# EAGLE design PCB (EAGLE 7.7.0)
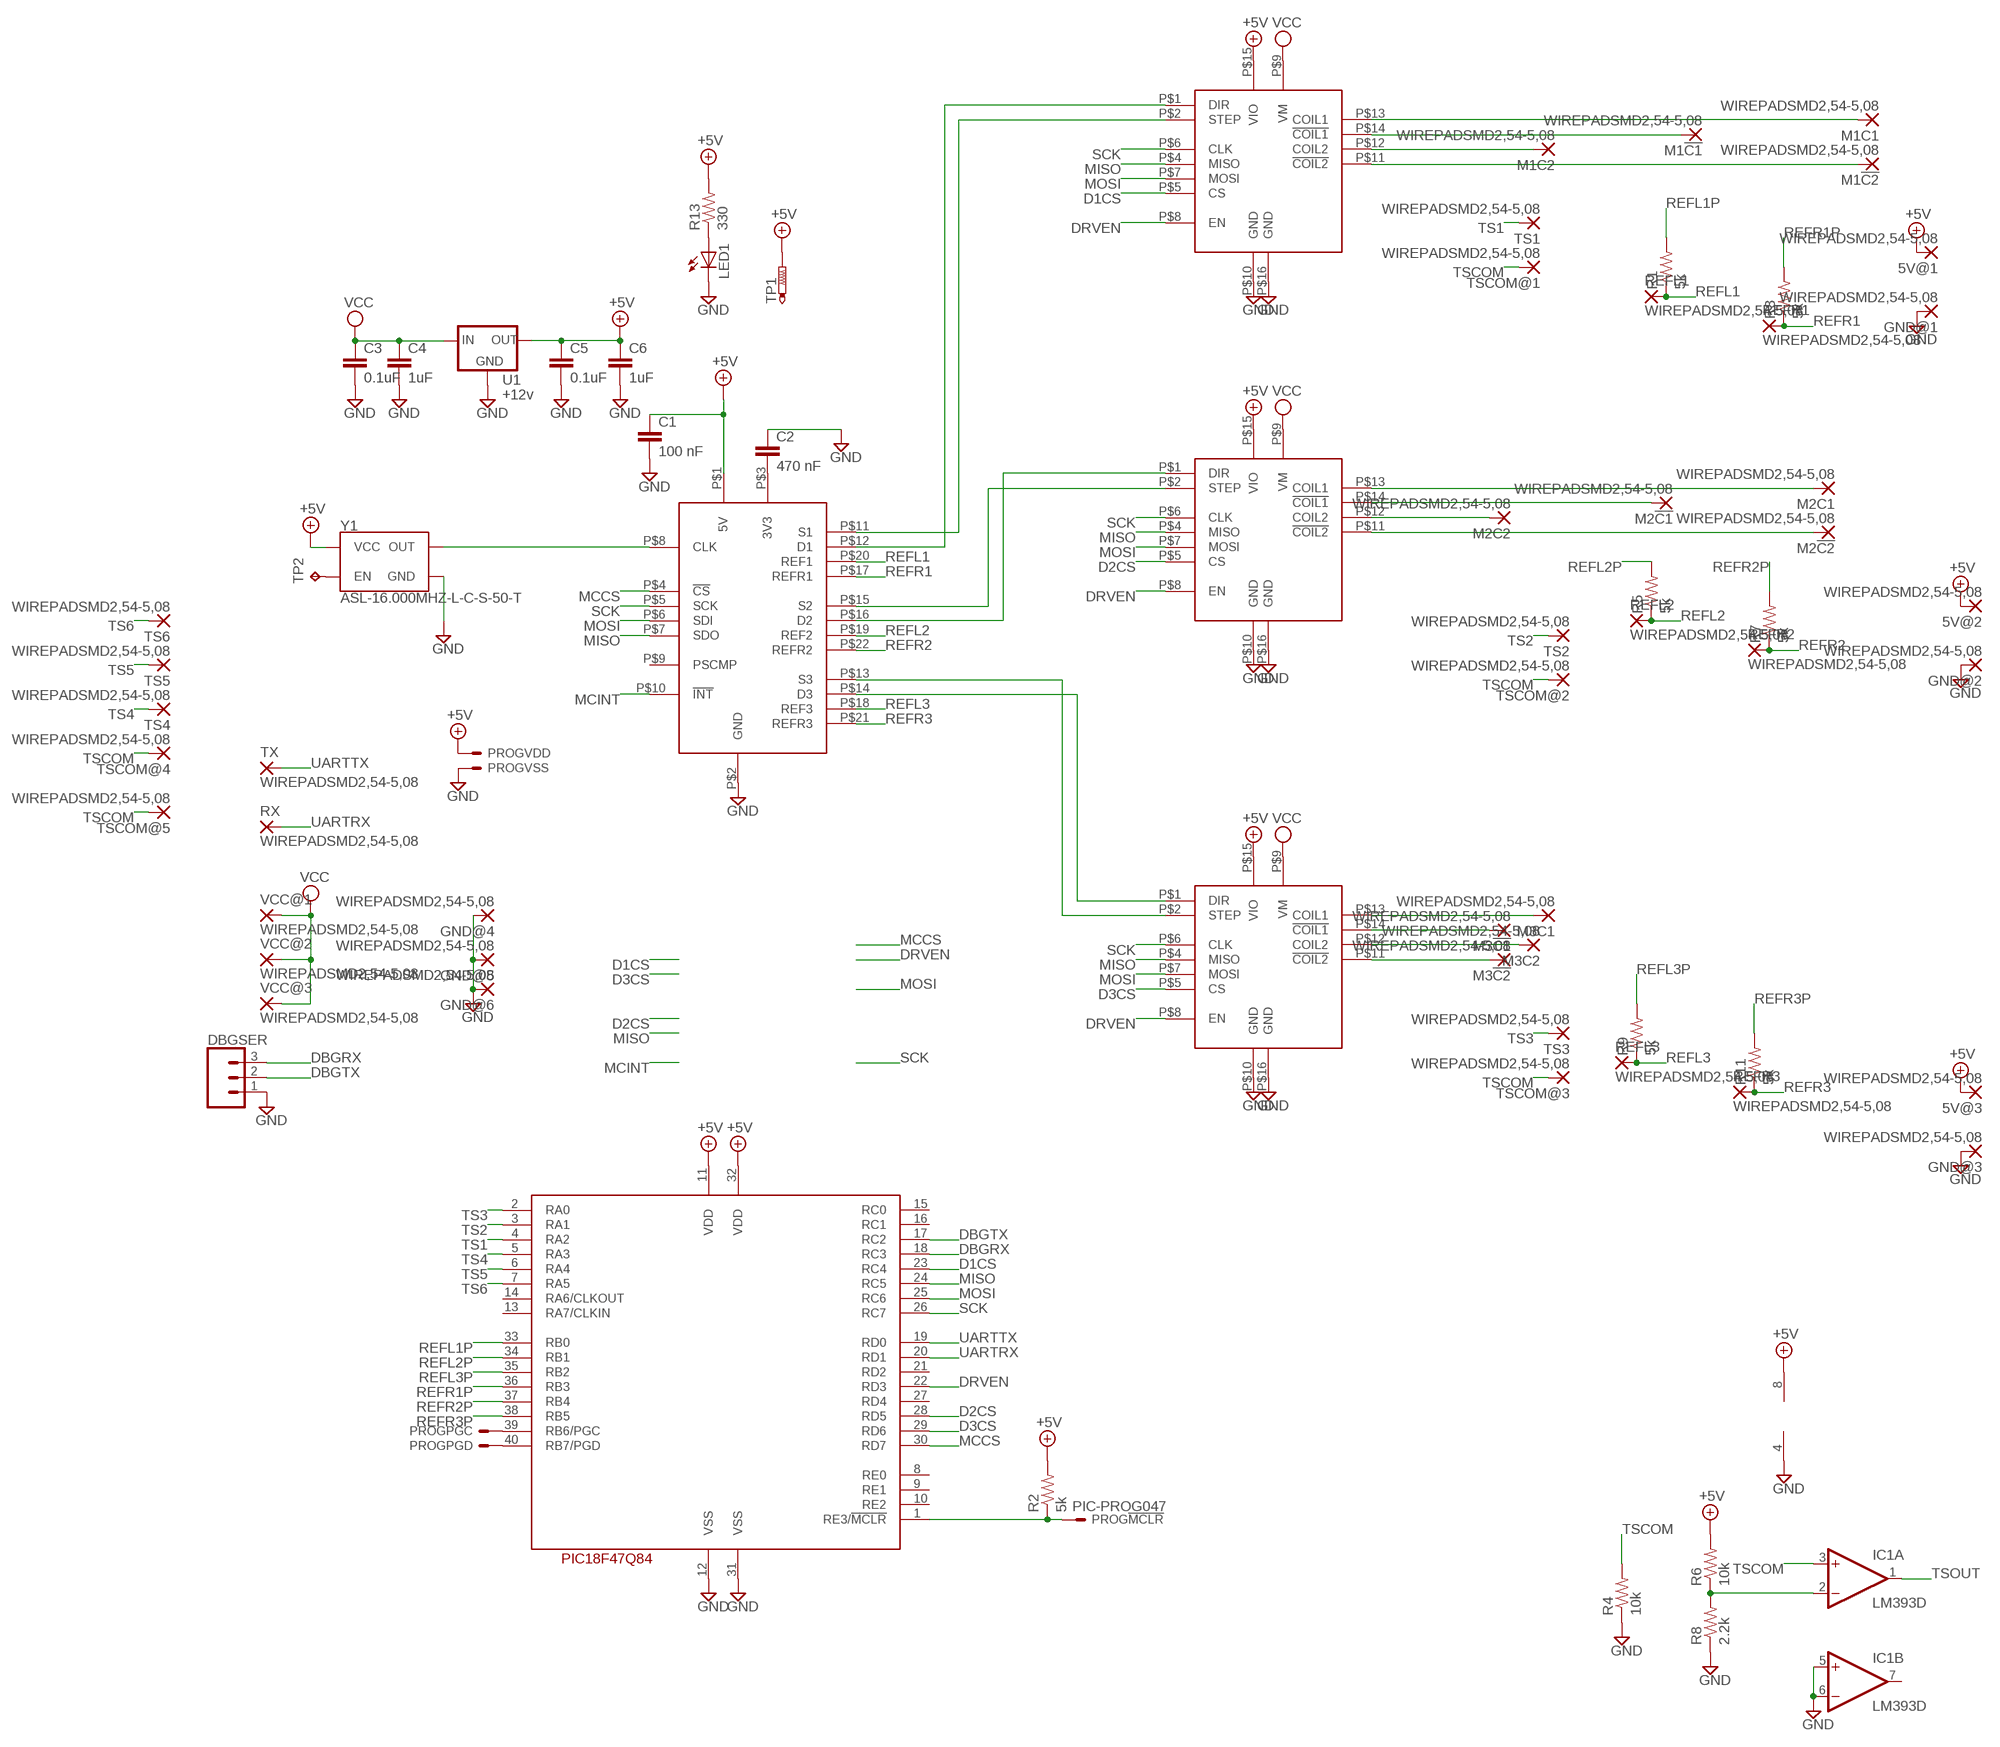
[diagram p0: schematic, sheet 1]

## Parts
5V@1  WIREPADSMD2,54-5,08  [SMD2,54-5,08]
5V@2  WIREPADSMD2,54-5,08  [SMD2,54-5,08]
5V@3  WIREPADSMD2,54-5,08  [SMD2,54-5,08]
C1  100 nF  C-EUC1206  [C1206]
C2  470 nF  C-EUC1206  [C1206]
C3  0.1uF  C-EUC1206  [C1206]
C4  1uF  C-EUC1206  [C1206]
C5  0.1uF  C-EUC1206  [C1206]
C6  1uF  C-EUC1206  [C1206]
DBGSER  CONN_03  [1X03]
DRV1  SILENTSTEPSTICK-DIPONLY  [SILENTSTEPSTICK-DIPONLY]
DRV2  SILENTSTEPSTICK-DIPONLY  [SILENTSTEPSTICK-DIPONLY]
DRV3  SILENTSTEPSTICK-DIPONLY  [SILENTSTEPSTICK-DIPONLY]
GND@1  WIREPADSMD2,54-5,08  [SMD2,54-5,08]
GND@2  WIREPADSMD2,54-5,08  [SMD2,54-5,08]
GND@3  WIREPADSMD2,54-5,08  [SMD2,54-5,08]
GND@4  WIREPADSMD2,54-5,08  [SMD2,54-5,08]
GND@5  WIREPADSMD2,54-5,08  [SMD2,54-5,08]
GND@6  WIREPADSMD2,54-5,08  [SMD2,54-5,08]
IC1  LM393D  [SO08]
LED1  LEDCHIPLED_1206  [CHIPLED_1206]
M1!C1  WIREPADSMD2,54-5,08  [SMD2,54-5,08]
M1!C2  WIREPADSMD2,54-5,08  [SMD2,54-5,08]
M1C1  WIREPADSMD2,54-5,08  [SMD2,54-5,08]
M1C2  WIREPADSMD2,54-5,08  [SMD2,54-5,08]
M2!C1  WIREPADSMD2,54-5,08  [SMD2,54-5,08]
M2!C2  WIREPADSMD2,54-5,08  [SMD2,54-5,08]
M2C1  WIREPADSMD2,54-5,08  [SMD2,54-5,08]
M2C2  WIREPADSMD2,54-5,08  [SMD2,54-5,08]
M3!C1  WIREPADSMD2,54-5,08  [SMD2,54-5,08]
M3!C2  WIREPADSMD2,54-5,08  [SMD2,54-5,08]
M3C1  WIREPADSMD2,54-5,08  [SMD2,54-5,08]
M3C2  WIREPADSMD2,54-5,08  [SMD2,54-5,08]
PROG  PIC-PROG047  [53047-05]
R1  5k  R-US_M1206  [M1206]
R2  5k  R-US_M1206  [M1206]
R3  5k  R-US_M1206  [M1206]
R4  10k  R-US_M1206  [M1206]
R5  5k  R-US_M1206  [M1206]
R6  10k  R-US_M1206  [M1206]
R7  5k  R-US_M1206  [M1206]
R8  2.2k  R-US_M1206  [M1206]
R9  5k  R-US_M1206  [M1206]
R11  5k  R-US_M1206  [M1206]
R13  330  R-US_M1206  [M1206]
REFL1  WIREPADSMD2,54-5,08  [SMD2,54-5,08]
REFL2  WIREPADSMD2,54-5,08  [SMD2,54-5,08]
REFL3  WIREPADSMD2,54-5,08  [SMD2,54-5,08]
REFR1  WIREPADSMD2,54-5,08  [SMD2,54-5,08]
REFR2  WIREPADSMD2,54-5,08  [SMD2,54-5,08]
REFR3  WIREPADSMD2,54-5,08  [SMD2,54-5,08]
RX  WIREPADSMD2,54-5,08  [SMD2,54-5,08]
TP1  PTR1PAD1-17  [P1-17]
TP2  TPB1,27  [B1,27]
TS1  WIREPADSMD2,54-5,08  [SMD2,54-5,08]
TS2  WIREPADSMD2,54-5,08  [SMD2,54-5,08]
TS3  WIREPADSMD2,54-5,08  [SMD2,54-5,08]
TS4  WIREPADSMD2,54-5,08  [SMD2,54-5,08]
TS5  WIREPADSMD2,54-5,08  [SMD2,54-5,08]
TS6  WIREPADSMD2,54-5,08  [SMD2,54-5,08]
TSCOM@1  WIREPADSMD2,54-5,08  [SMD2,54-5,08]
TSCOM@2  WIREPADSMD2,54-5,08  [SMD2,54-5,08]
TSCOM@3  WIREPADSMD2,54-5,08  [SMD2,54-5,08]
TSCOM@4  WIREPADSMD2,54-5,08  [SMD2,54-5,08]
TSCOM@5  WIREPADSMD2,54-5,08  [SMD2,54-5,08]
TX  WIREPADSMD2,54-5,08  [SMD2,54-5,08]
U1  +12v  V_REG_78XX7812  [TO-252]
U2  PIC18F47Q84  [DIL40]
U$1  TMC429-BOB  [TMC429-BOB]
VCC@1  WIREPADSMD2,54-5,08  [SMD2,54-5,08]
VCC@2  WIREPADSMD2,54-5,08  [SMD2,54-5,08]
VCC@3  WIREPADSMD2,54-5,08  [SMD2,54-5,08]
Y1  ASL-16.000MHZ-L-C-S-50-T  OSCILLATORSMD-7X5-4PAD  [OSCILLATOR-SMD-7X5-4PAD]

## Nets
+5V: 5V@1.1(P) 5V@2.1(P) 5V@3.1(P) C1.1 C5.1 C6.1 DRV1.P$15(VIO) DRV2.P$15(VIO) DRV3.P$15(VIO) IC1.8(P:V+) PROG.2 R2.2 R6.2 R13.2 TP1.TP U1.2(OUT) U2.11(VDD) U2.32(VDD) U$1.P$1(5V) Y1.4(VCC)
D1CS: DRV1.P$5(CS) U2.23(RC4)
D2CS: DRV2.P$5(CS) U2.28(RD5)
D3CS: DRV3.P$5(CS) U2.29(RD6)
DBGRX: DBGSER.3 U2.18(RC3)
DBGTX: DBGSER.2 U2.17(RC2)
DRVEN: DRV1.P$8(EN) DRV2.P$8(EN) DRV3.P$8(EN) U2.22(RD3)
GND: C1.2 C2.1 C3.2 C4.2 C5.2 C6.2 DBGSER.1 DRV1.P$10(GND) DRV1.P$16(GND) DRV2.P$10(GND) DRV2.P$16(GND) DRV3.P$10(GND) DRV3.P$16(GND) GND@1.1(P) GND@2.1(P) GND@3.1(P) GND@4.1(P) GND@5.1(P) GND@6.1(P) IC1.4(P:V-) IC1.5(B:+IN) IC1.6(B:-IN) LED1.C PROG.3 R4.1 R8.1 U1.3(GND) U2.12(VSS) U2.31(VSS) U$1.P$2(GND) Y1.2(GND)
MCCS: U2.30(RD7) U$1.P$4(!CS)
MCINT: U$1.P$10(!INT)
MISO: DRV1.P$4(MISO) DRV2.P$4(MISO) DRV3.P$4(MISO) U2.24(RC5) U$1.P$7(SDO)
MOSI: DRV1.P$7(MOSI) DRV2.P$7(MOSI) DRV3.P$7(MOSI) U2.25(RC6) U$1.P$6(SDI)
N$1: DRV1.P$1(DIR) U$1.P$12(D1)
N$2: DRV1.P$2(STEP) U$1.P$11(S1)
N$3: DRV2.P$2(STEP) U$1.P$15(S2)
N$4: DRV2.P$1(DIR) U$1.P$16(D2)
N$5: DRV3.P$2(STEP) U$1.P$13(S3)
N$6: DRV3.P$1(DIR) U$1.P$14(D3)
N$7: C2.2 U$1.P$3(3V3)
N$8: DRV1.P$13(COIL1) M1C1.1(P)
N$9: DRV1.P$12(COIL2) M1C2.1(P)
N$10: DRV1.P$14(!COIL1) M1!C1.1(P)
N$11: DRV1.P$11(!COIL2) M1!C2.1(P)
N$12: DRV2.P$14(!COIL1) M2!C1.1(P)
N$13: DRV2.P$12(COIL2) M2C2.1(P)
N$14: DRV2.P$11(!COIL2) M2!C2.1(P)
N$15: DRV2.P$13(COIL1) M2C1.1(P)
N$16: DRV3.P$14(!COIL1) M3!C1.1(P)
N$17: DRV3.P$12(COIL2) M3C2.1(P)
N$18: DRV3.P$13(COIL1) M3C1.1(P)
N$19: DRV3.P$11(!COIL2) M3!C2.1(P)
N$20: PROG.4 U2.40(RB7/PGD)
N$21: PROG.1 R2.1 U2.1(RE3/!MCLR)
N$22: PROG.5 U2.39(RB6/PGC)
N$23: U$1.P$8(CLK) Y1.3(OUT)
N$24: TP2.TP Y1.1(EN)
N$26: IC1.2(A:-IN) R6.1 R8.2
N$32: LED1.A R13.1
REFL1: R1.1 REFL1.1(P) U$1.P$20(REF1)
REFL1P: R1.2 U2.33(RB0)
REFL2: R5.1 REFL2.1(P) U$1.P$19(REF2)
REFL2P: R5.2 U2.34(RB1)
REFL3: R9.1 REFL3.1(P) U$1.P$18(REF3)
REFL3P: R9.2 U2.35(RB2)
REFR1: R3.1 REFR1.1(P) U$1.P$17(REFR1)
REFR1P: R3.2 U2.36(RB3)
REFR2: R7.1 REFR2.1(P) U$1.P$22(REFR2)
REFR2P: R7.2 U2.37(RB4)
REFR3: R11.1 REFR3.1(P) U$1.P$21(REFR3)
REFR3P: R11.2 U2.38(RB5)
SCK: DRV1.P$6(CLK) DRV2.P$6(CLK) DRV3.P$6(CLK) U2.26(RC7) U$1.P$5(SCK)
TS1: TS1.1(P) U2.4(RA2)
TS2: TS2.1(P) U2.3(RA1)
TS3: TS3.1(P) U2.2(RA0)
TS4: TS4.1(P) U2.5(RA3)
TS5: TS5.1(P) U2.6(RA4)
TS6: TS6.1(P) U2.7(RA5)
TSCOM: IC1.3(A:+IN) R4.2 TSCOM@1.1(P) TSCOM@2.1(P) TSCOM@3.1(P) TSCOM@4.1(P) TSCOM@5.1(P)
TSOUT: IC1.1(A:OUT)
UARTRX: RX.1(P) U2.20(RD1)
UARTTX: TX.1(P) U2.19(RD0)
VCC: C3.1 C4.1 DRV1.P$9(VM) DRV2.P$9(VM) DRV3.P$9(VM) U1.1(IN) VCC@1.1(P) VCC@2.1(P) VCC@3.1(P)
Unconnected: IC1.7(B:OUT) U2.8(RE0) U2.9(RE1) U2.10(RE2) U2.13(RA7/CLKIN) U2.14(RA6/CLKOUT) U2.15(RC0) U2.16(RC1) U2.21(RD2) U2.27(RD4) U$1.P$9(PSCMP)

## Library data of the parts
5V@1-5V@3 GND@1-GND@6 M1!C1 M1!C2 M1C1 M1C2 M2!C1 M2!C2 M2C1 M2C2 M3!C1 M3!C2 M3C1 M3C2 REFL1-REFL3 REFR1-REFR3 RX TS1-TS6 TSCOM@1-TSCOM@5 TX VCC@1-VCC@3 = wirepad:WIREPAD: Wire PAD connect wire on PCB
C1-C6 = resistor:C-EU: CAPACITOR, European symbol
DBGSER = SparkFun-Connectors:CONN_03: Multi connection point. Often used as Generic Header-pin footprint for 0.1 inch spaced/style header connections On any of the 0.1 inch spaced packages, you can populate with these: Break Away Headers - Straight <https://www.sparkfun.com/products/116> (PRT-00116) Break Away Male Headers - Right Angle <https://www.sparkfun.com/products/553> (PRT-00553) Female Headers <https://www.sparkfun.com/products/115> (PRT-00115) Break Away Headers - Machine Pin <https://www.sparkfun.com/products/117> (PRT-00117) Break Away Female Headers - Swiss Machine Pin <https://www.sparkfun.com/products/743> (PRT-00743) Stackable Header - 3 Pin (Female, 0.1") <https://www.sparkfun.com/products/13875> (PRT-13875) For SCREWTERMINALS and SPRING TERMINALS visit here: Screw Terimnals on SparkFun.com <https://www.sparkfun.com/search/results?term=Screw+Terminals> (5mm/3.5mm/2.54mm spacing) This device is also useful as a general connection point to wire up your design to another part of your project. Our various solder wires solder well into these plated through hole pads. Hook-Up Wire - Assortment (Stranded, 22 AWG) <https://www.sparkfun.com/products/11375> (PRT-11375) Hook-Up Wire - Assortment (Solid Core, 22 AWG) <https://www.sparkfun.com/products/11367> (PRT-11367) View the entire wire category on our website here <https://www.sparkfun.com/categories/141> Special notes: Molex polarized connector foot print use with SKU : PRT-08232 with associated crimp pins and housings.
DRV1-DRV3 = FRC696:SILENTSTEPSTICK-DIPONLY
IC1 = linear:LM393: COMPARATOR
LED1 = led:LED: LED OSRAM: - CHIPLED LG R971, LG N971, LY N971, LG Q971, LY Q971, LO R971, LY R971 LH N974, LH R974 LS Q976, LO Q976, LY Q976 LO Q996 - Hyper CHIPLED LW Q18S LB Q993, LB Q99A, LB R99A - SideLED LS A670, LO A670, LY A670, LG A670, LP A670 LB A673, LV A673, LT A673, LW A673 LH A674 LY A675 LS A676, LA A676, LO A676, LY A676, LW A676 LS A679, LY A679, LG A679 - Hyper Micro SIDELED® LS Y876, LA Y876, LO Y876, LY Y876 LT Y87S - SmartLED LW L88C, LW L88S LB L89C, LB L89S, LG L890 LS L89K, LO L89K, LY L89K LS L896, LA L896, LO L896, LY L896 - TOPLED LS T670, LO T670, LY T670, LG T670, LP T670 LSG T670, LSP T670, LSY T670, LOP T670, LYG T670 LG T671, LOG T671, LSG T671 LB T673, LV T673, LT T673, LW T673 LH T674 LS T676, LA T676, LO T676, LY T676, LB T676, LH T676, LSB T676, LW T676 LB T67C, LV T67C, LT T67C, LS T67K, LO T67K, LY T67K, LW E67C LS E67B, LA E67B, LO E67B, LY E67B, LB E67C, LV E67C, LT E67C LW T67C LS T679, LY T679, LG T679 LS T770, LO T770, LY T770, LG T770, LP T770 LB T773, LV T773, LT T773, LW T773 LH T774 LS E675, LA E675, LY E675, LS T675 LS T776, LA T776, LO T776, LY T776, LB T776 LHGB T686 LT T68C, LB T68C - Hyper Mini TOPLED® LB M676 - Mini TOPLED Santana® LG M470 LS M47K, LO M47K, LY M47K Source: http://www.osram.convergy.de LUXEON: - LUMILED® LXK2-PW12-R00, LXK2-PW12-S00, LXK2-PW14-U00, LXK2-PW14-V00 LXK2-PM12-R00, LXK2-PM12-S00, LXK2-PM14-U00 LXK2-PE12-Q00, LXK2-PE12-R00, LXK2-PE12-S00, LXK2-PE14-T00, LXK2-PE14-U00 LXK2-PB12-K00, LXK2-PB12-L00, LXK2-PB12-M00, LXK2-PB14-N00, LXK2-PB14-P00, LXK2-PB14-Q00 LXK2-PR12-L00, LXK2-PR12-M00, LXK2-PR14-Q00, LXK2-PR14-R00 LXK2-PD12-Q00, LXK2-PD12-R00, LXK2-PD12-S00 LXK2-PH12-R00, LXK2-PH12-S00 LXK2-PL12-P00, LXK2-PL12-Q00, LXK2-PL12-R00 Source: www.luxeon.com KINGBRIGHT: KA-3528ASYC Source: www.kingbright.com
PROG = FRC696:PIC-PROG: CONNECTOR wire to board 1.25 mm (.049 inch) pitch header; MF: MOLEX; MPN: 53047-0510; OC_FARNELL: 9732861; OC_NEWARK: 38C9901
R1-R9 R11 R13 = resistor:R-US_: RESISTOR, American symbol
TP1 = testpad:PTR1: TEST PIN
TP2 = testpad:TP: Test pad
U1 = SparkFun-IC-Power:V_REG_78XX: Voltage Regulator Standard 78xx regulator. IGO (Input Ground Output). Spark Fun Electronics SKU : COM-00107; PROD_ID: VREG-12370
U2 = FRC696:PIC18F47Q84
U$1 = FRC696:TMC429-BOB
Y1 = SparkFun-Clocks:OSCILLATOR: Oscillators (Generic) These are active oscillators, which require a power source to generate their clock output. Most oscillators are configured to generate a set frequency (e.g. 16MHz). They have four pins: power, ground, output, and an enable input.

## Board
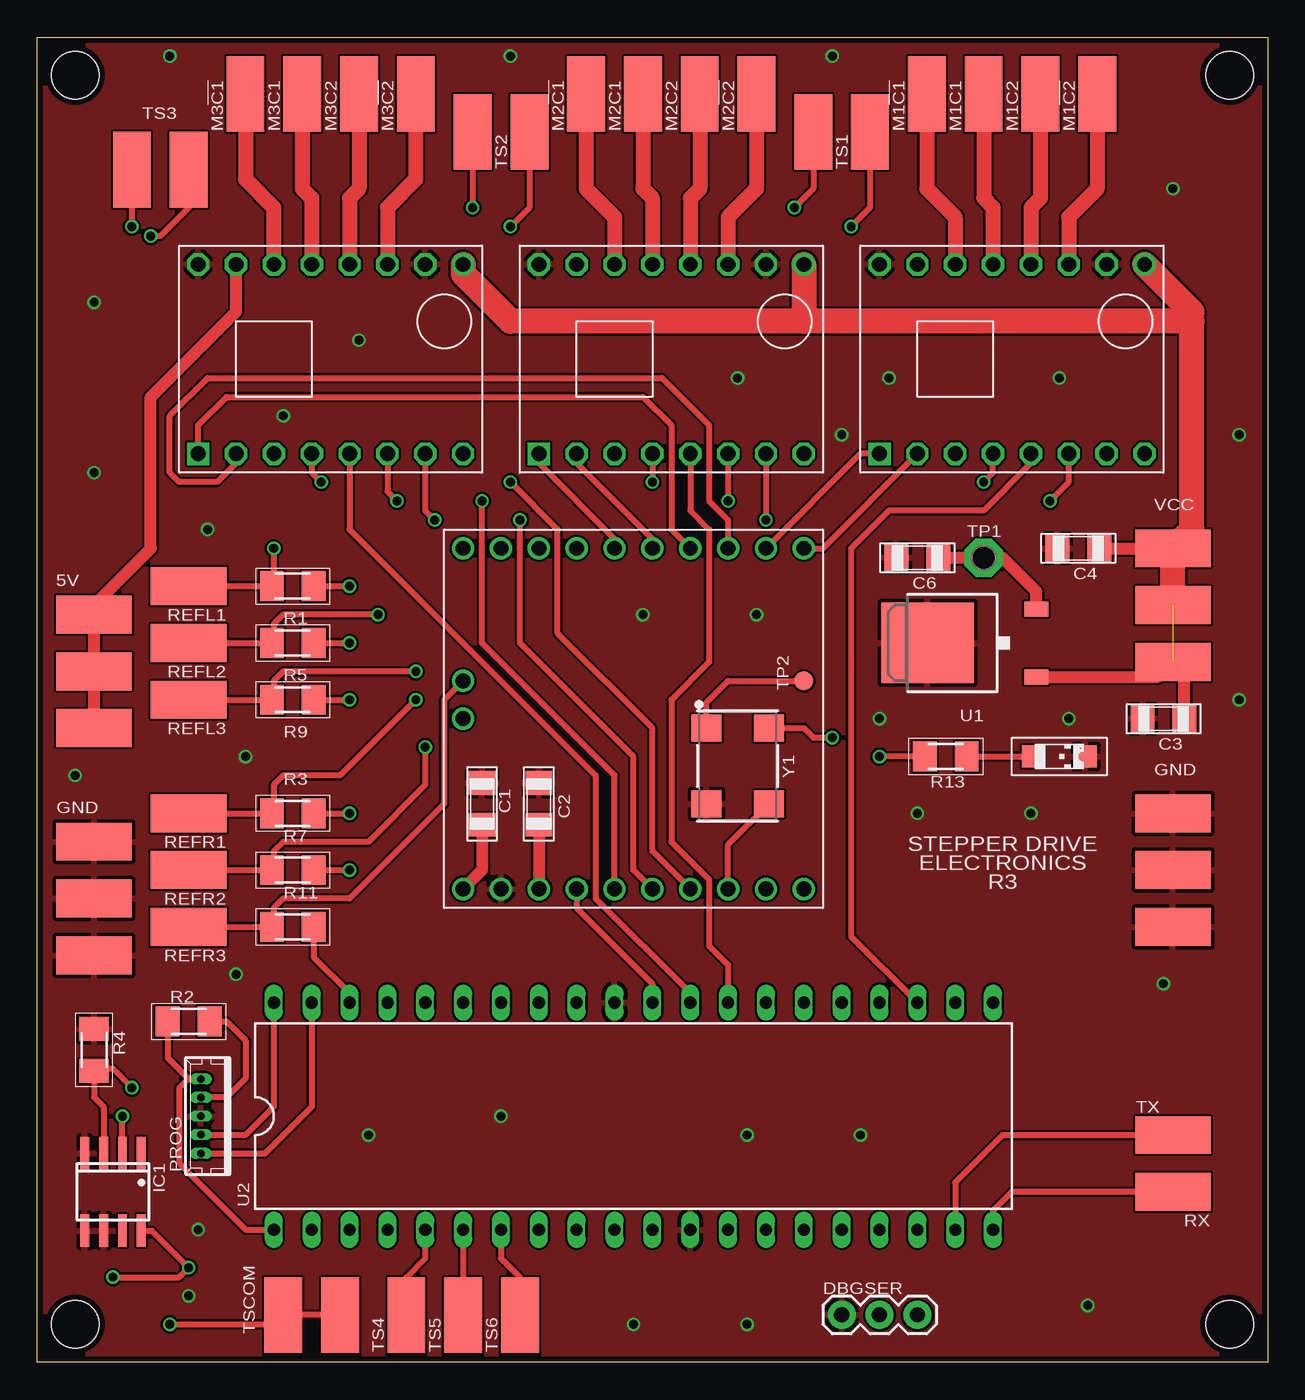
[diagram p1: board, top side]
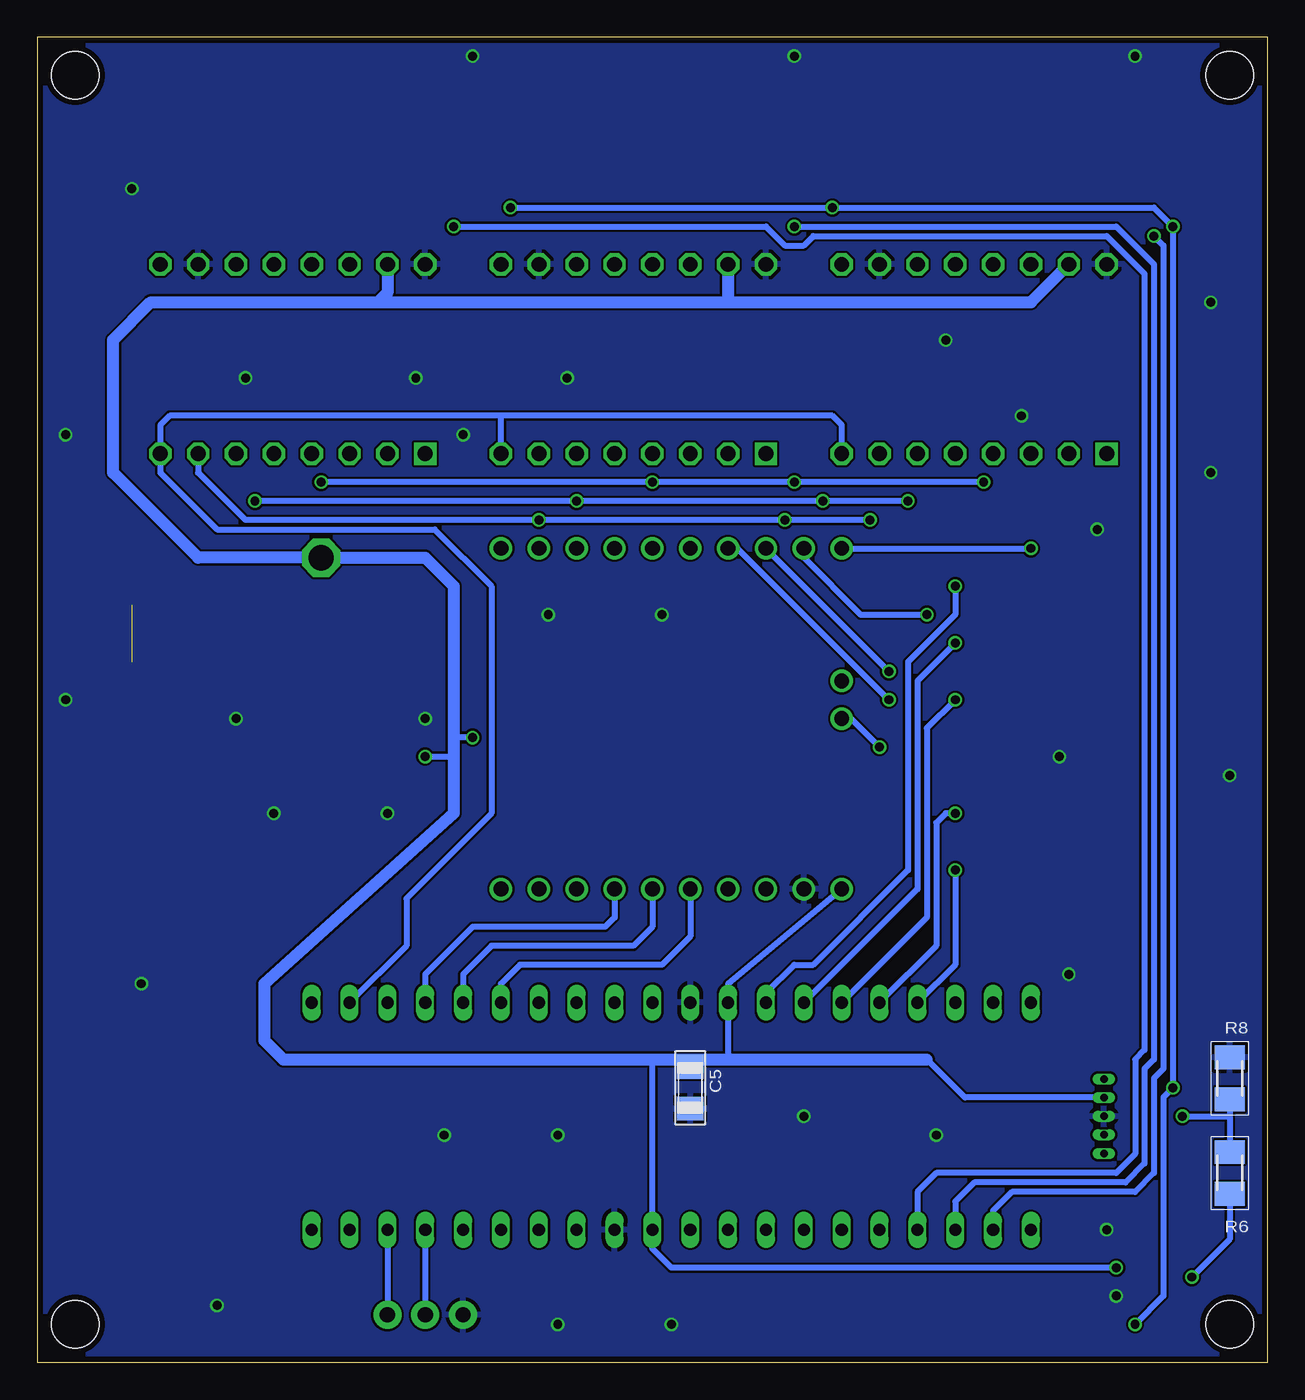
[diagram p2: board, bottom side, seen from below]

Size 82.55 x 88.9 mm. Coordinates in mm from the lower left corner, seen from the top.
Outline: 0,88.9 82.55,88.9 82.55,0 0,0 0,88.9
Copper layers (1*16): Top 0.035559375mm / dielectric 1.6mm / Bottom 0.035559375mm
Design rules "oshpark-2layer": minimum track width 6mil, minimum drill 10mil, track to track 6mil, track to pad 6mil, pad to pad 6mil, via to via 6mil, smd to smd 6mil, copper to edge 15mil, drill to drill 6mil, minimum pad ring 5mil, minimum via ring 5mil, stop-mask expansion 2.5mil, vias tented up to drill 0mil, thermal gap 10mil
Holes 3.2 mm at 80.01,2.54 80.01,86.36 2.54,86.36 2.54,2.54

### Footprints (pad centres in the part's own frame; a part is rotated, then mirrored left to right if it is on the bottom)
SMD2,54-5,08 = smd 2.54 x 5.08: 1 0,0
C1206 = smd 1.6 x 1.8: 1 -1.4,0; 2 1.4,0
1X03 = drill 1.016 pad 1.88: 1 0,0; 2 2.54,0; 3 5.08,0
SILENTSTEPSTICK-DIPONLY = drill 1 square: P$1 -6.35,7.62 | drill 1 octagon: P$2 -6.35,5.08; P$3 -6.35,2.54; P$4 -6.35,0; P$5 -6.35,-2.54; P$6 -6.35,-5.08; P$7 -6.35,-7.62; P$8 -6.35,-10.16; P$9 6.35,-10.16; P$10 6.35,-7.62; P$11 6.35,-5.08; P$12 6.35,-2.54; P$13 6.35,0; P$14 6.35,2.54; P$15 6.35,5.08; P$16 6.35,7.62
SO08 = smd 0.6 x 2.2: 1 -1.905,-2.6; 2 -0.635,-2.6; 3 0.635,-2.6; 4 1.905,-2.6; 5 1.905,2.6; 6 0.635,2.6; 7 -0.635,2.6; 8 -1.905,2.6
CHIPLED_1206 = smd 1.5 x 1.5: A 0,-1.75; C 0,1.75
53047-05 = drill 0.5 pad 0.698 long: 1 2.5,0.45; 2 1.25,0.45; 3 0,0.45; 4 -1.25,0.45; 5 -2.5,0.45
M1206 = smd 1.6 x 2: 1 -1.4,0; 2 1.4,0
P1-17 = drill 1.702 pad 2.54 octagon: TP 0,0
B1,27 = smd 1.27 x 1.27: TP 0,0
TO-252 = smd 1 x 1.6: 1 -2.28,-4.8; 2 2.28,-4.8 | smd 5.4 x 6.2: 3 0,2.5
DIL40 = drill 0.813 long: 1 -24.13,-7.62; 2 -21.59,-7.62; 3 -19.05,-7.62; 4 -16.51,-7.62; 5 -13.97,-7.62; 6 -11.43,-7.62; 7 -8.89,-7.62; 8 -6.35,-7.62; 9 -3.81,-7.62; 10 -1.27,-7.62; 11 1.27,-7.62; 12 3.81,-7.62; 13 6.35,-7.62; 14 8.89,-7.62; 15 11.43,-7.62; 16 13.97,-7.62; 17 16.51,-7.62; 18 19.05,-7.62; 19 21.59,-7.62; 20 24.13,-7.62; 21 24.13,7.62; 22 21.59,7.62; 23 19.05,7.62; 24 16.51,7.62; 25 13.97,7.62; 26 11.43,7.62; 27 8.89,7.62; 28 6.35,7.62; 29 3.81,7.62; 30 1.27,7.62; 31 -1.27,7.62; 32 -3.81,7.62; 33 -6.35,7.62; 34 -8.89,7.62; 35 -11.43,7.62; 36 -13.97,7.62; 37 -16.51,7.62; 38 -19.05,7.62; 39 -21.59,7.62; 40 -24.13,7.62
TMC429-BOB = drill 1: P$1 -11.43,10.16; P$2 -11.43,7.62; P$3 -11.43,5.08; P$4 -11.43,2.54; P$5 -11.43,0; P$6 -11.43,-2.54; P$7 -11.43,-5.08; P$8 -11.43,-7.62; P$9 -11.43,-10.16; P$10 -11.43,-12.7; P$11 11.43,-12.7; P$12 11.43,-10.16; P$13 11.43,-7.62; P$14 11.43,-5.08; P$15 11.43,-2.54; P$16 11.43,0; P$17 11.43,2.54; P$18 11.43,5.08; P$19 11.43,7.62; P$20 11.43,10.16; P$21 2.54,10.16; P$22 0,10.16
OSCILLATOR-SMD-7X5-4PAD = smd 1.8 x 2: 1 -2.54,-2.095; 2 2.54,-2.095; 3 2.54,2.104; 4 -2.54,2.104

### Placement (x,y rotation side)
5V@1  3.81,50.16 90 top
5V@2  3.81,46.35 90 top
5V@3  3.81,42.55 90 top
C1  29.84,37.47 90 top
C2  33.66,37.47 270 top
C3  75.56,43.18 180 top
C4  69.85,54.61 180 top
C5  38.73,18.41 270 bottom
C6  59.05,53.98 180 top
DBGSER  53.98,3.17 0 top
DRV1  64.14,67.31 90 top
DRV2  41.27,67.31 90 top
DRV3  18.41,67.31 90 top
GND@1  3.81,34.92 90 top
GND@2  3.81,31.11 90 top
GND@3  3.81,27.3 90 top
GND@4  76.2,33.02 90 top
GND@5  76.2,36.83 90 top
GND@6  76.2,29.21 90 top
IC1  5.08,11.43 180 top
LED1  68.58,40.64 270 top
M1!C1  59.69,85.09 0 top
M1!C2  71.12,85.09 0 top
M1C1  63.5,85.09 0 top
M1C2  67.31,85.09 0 top
M2!C1  36.83,85.09 0 top
M2!C2  48.26,85.09 0 top
M2C1  40.64,85.09 0 top
M2C2  44.45,85.09 0 top
M3!C1  13.97,85.09 0 top
M3!C2  25.4,85.09 0 top
M3C1  17.78,85.09 0 top
M3C2  21.59,85.09 0 top
PROG  11.43,16.51 90 top
R1  17.14,52.07 0 top
R2  10.16,22.86 0 top
R3  17.14,36.83 0 top
R4  3.81,20.95 270 top
R5  17.14,48.26 0 top
R6  2.54,12.7 270 bottom
R7  17.14,33.02 0 top
R8  2.54,19.05 270 bottom
R9  17.14,44.45 0 top
R11  17.14,29.21 0 top
R13  60.96,40.64 180 top
REFL1  10.16,52.07 90 top
REFL2  10.16,48.26 90 top
REFL3  10.16,44.45 90 top
REFR1  10.16,36.83 90 top
REFR2  10.16,33.02 90 top
REFR3  10.16,29.21 90 top
RX  76.2,11.43 90 top
TP1  63.5,53.98 0 top
TP2  51.44,45.72 90 top
TS1  55.88,82.55 0 top
TS2  33.02,82.55 0 top
TS3  10.16,80.01 0 top
TS4  24.77,3.17 0 top
TS5  28.57,3.17 0 top
TS6  32.38,3.17 0 top
TSCOM@1  52.07,82.55 0 top
TSCOM@2  29.21,82.55 0 top
TSCOM@3  6.35,80.01 0 top
TSCOM@4  16.51,3.17 0 top
TSCOM@5  20.32,3.17 0 top
TX  76.2,15.24 270 top
U1  62.23,48.26 90 top
U2  40.01,16.51 0 top
U$1  38.73,43.18 90 top
VCC@1  76.2,50.8 90 top
VCC@2  76.2,54.61 90 top
VCC@3  76.2,46.99 90 top
Y1  46.99,40.01 270 top

### Tracks (layer width: path | path; a pad name or v marks a point on that pad's centre or on a via)
+5V  (via drill 0.6)
  Top 0.406: Y1.4 51.44,42.55 52.07,41.91 v53.34,41.91 | R13.2 v56.52,40.64 | R2.2 12.7,22.86 13.97,21.59 13.97,19.03 12.7,17.76 PROG.2 | IC1.8 7.68,8.83 v10.16,6.35 9.53,5.71 v5.08,5.71
  Top 0.813: U1.2 67.03,51.72 64.77,53.98 TP1.TP C6.1 | 5V@3.1 5V@2.1 5V@1.1 3.81,50.8 7.62,54.61 7.62,64.77 13.34,70.48 DRV3.P$15 | C1.1 29.84,33.02 U$1.P$1
  Bottom 0.406: 36.2,20.32 U2.32 36.2,25.4 U$1.P$1 | PROG.2 20.3,17.76 22.86,20.32 | 41.27,20.32 U2.11 41.27,7.62 40.01,6.35 v10.16,6.35 | v53.34,41.91 54.61,41.91 | v56.52,40.64 54.61,40.64 | R6.2 2.54,8.26 v5.08,5.71
  Bottom 0.813: 59.69,71.12 74.93,71.12 77.47,68.58 77.47,59.69 71.75,53.98 TP1.TP 56.52,53.98 54.61,52.07 54.61,41.91 54.61,40.64 54.61,36.83 67.31,25.4 67.31,21.59 66.04,20.32 41.27,20.32 39.37,20.32 | 59.69,71.12 36.2,71.12 | 36.2,71.12 15.88,71.12 DRV3.P$15 | DRV2.P$15 36.2,71.12 | DRV1.P$15 59.05,71.75 59.69,71.12 | 39.37,20.32 36.2,20.32 22.86,20.32 | C5.1 38.87,19.82 39.37,20.32
D1CS
  Top 0.406: DRV1.P$5 66.67,60.33 63.5,57.15 57.15,57.15 54.61,54.61 54.61,28.57 U2.23
D2CS
  Top 0.406: DRV2.P$5 43.81,57.15 45.09,55.88 45.09,46.99 42.55,44.45 42.55,34.92 45.09,32.38 45.09,27.94 46.35,26.67 U2.28
D3CS
  Top 0.406: DRV3.P$5 20.95,55.88 37.47,39.37 37.47,31.11 43.81,24.77 U2.29
DBGRX
  Bottom 0.406: U2.18 DBGSER.3
DBGTX
  Bottom 0.406: U2.17 DBGSER.2
DRVEN
  Bottom 0.406: DRV3.P$8 28.57,62.87 29.21,63.5 51.44,63.5 | 51.44,63.5 73.66,63.5 74.3,62.87 DRV1.P$8 74.3,59.69 70.48,55.88 55.88,55.88 52.07,52.07 52.07,36.83 57.78,31.11 57.78,27.94 U2.22 | DRV2.P$8 51.44,63.5
GND  (via drill 0.6)
  other vias: 13.97,40.64 11.43,55.88 3.81,59.69 3.81,71.12 8.89,87.63 31.75,87.63 53.34,87.63 76.2,78.74 68.58,66.04 57.15,66.04 46.99,66.04 21.59,68.58 16.51,63.5 53.98,62.23 80.64,62.23 80.64,44.45 59.05,36.83 66.67,36.83 56.52,43.18 69.22,43.18 75.56,25.4 55.24,15.24 47.62,15.24 31.11,16.51 22.23,15.24 40.01,2.54 47.62,2.54 70.48,3.81 13.34,26.04 2.54,39.37 10.79,8.89 10.16,4.45 40.64,50.16 48.26,50.16
  pour Bottom: -11.43,101.6 92.71,101.6 92.71,-12.7 -11.43,-12.7
  pour Top: -6.35,97.79 87.63,97.79 87.63,-7.62 -6.35,-7.62
MCCS
  Top 0.406: U$1.P$4 36.2,30.48 41.27,25.4 U2.30
MISO  (via drill 0.6)
  Top 0.406: DRV3.P$4 18.41,59.69 v19.05,59.05 | v63.5,59.05 64.14,59.69 DRV1.P$4 | DRV2.P$4 v41.27,59.05 | U$1.P$7 41.27,34.29 41.27,42.55 34.92,48.9 34.92,55.88 v31.75,59.05
  Bottom 0.406: v19.05,59.05 v31.75,59.05 v41.27,59.05 v63.5,59.05 | U$1.P$7 43.81,29.84 44.45,29.21 53.34,29.21 56.52,26.04 U2.24
MOSI  (via drill 0.6)
  Top 0.406: DRV3.P$7 26.04,57.15 v26.67,56.52 | DRV2.P$7 v48.9,56.52 | U$1.P$6 40.01,33.02 40.01,40.64 32.38,48.26 v32.38,56.52
  Bottom 0.406: v26.67,56.52 v32.38,56.52 v48.9,56.52 68.58,56.52 71.75,59.69 DRV1.P$7 | U$1.P$6 41.27,29.21 42.55,27.94 52.07,27.94 53.98,26.04 U2.25
N$1
  Top 0.406: DRV1.P$1 55.24,60.96 U$1.P$12
N$2
  Top 0.406: U$1.P$11 52.7,54.61 DRV1.P$2
N$3
  Top 0.406: DRV2.P$2 36.2,60.33 41.27,55.24 U$1.P$15
N$4
  Top 0.406: DRV2.P$1 33.66,60.33 38.73,55.24 U$1.P$16
N$5
  Top 0.406: DRV3.P$2 13.34,60.33 12.06,59.05 9.53,59.05 8.89,59.69 8.89,63.5 11.43,66.04 41.91,66.04 45.09,62.87 45.09,57.78 46.35,56.52 U$1.P$13
N$6
  Top 0.406: DRV3.P$1 10.79,62.87 12.7,64.77 40.64,64.77 42.55,62.87 42.55,55.88 U$1.P$14
N$7
  Top 0.813: C2.2 U$1.P$3
N$8
  Top 1.016: M1C1.1 63.5,78.11 64.14,77.47 DRV1.P$13
N$9
  Top 1.016: M1C2.1 67.31,78.11 66.67,77.47 DRV1.P$12
N$10
  Top 1.016: M1!C1.1 59.69,78.74 61.59,76.83 DRV1.P$14
N$11
  Top 1.016: M1!C2.1 71.12,78.74 69.22,76.83 DRV1.P$11
N$12
  Top 1.016: M2!C1.1 36.83,78.74 38.73,76.83 DRV2.P$14
N$13
  Top 1.016: M2C2.1 44.45,78.74 43.81,78.11 DRV2.P$12
N$14
  Top 1.016: M2!C2.1 48.26,78.74 46.35,76.83 DRV2.P$11
N$15
  Top 1.016: M2C1.1 40.64,78.74 41.27,78.11 DRV2.P$13
N$16
  Top 1.016: M3!C1.1 13.97,79.38 15.88,77.47 DRV3.P$14
N$17
  Top 1.016: M3C2.1 21.59,78.74 20.95,78.11 DRV3.P$12
N$18
  Top 1.016: M3C1.1 17.78,78.74 18.41,78.11 DRV3.P$13
N$19
  Top 1.016: M3!C2.1 25.4,79.38 23.5,77.47 DRV3.P$11
N$20
  Top 0.406: PROG.4 13.99,15.26 15.88,17.14 U2.40
N$21
  Top 0.406: PROG.1 10.16,19.01 | 10.16,19.01 10.12,19.01 9.53,18.41 9.53,13.34 13.97,8.89 U2.1 | R2.1 8.76,20.41 10.16,19.01
N$22
  Top 0.406: U2.39 18.41,17.14 15.28,14.01 PROG.5
N$23
  Top 0.406: U$1.P$8 46.35,34.73 Y1.3
N$24
  Top 0.406: Y1.1 44.9,44.26 46.35,45.72 TP2.TP
N$26  (via drill 0.6)
  Top 0.406: IC1.2 v5.71,16.51
  Bottom 0.406: R8.2 2.54,16.51 | 2.54,16.51 R6.1 | v5.71,16.51 2.54,16.51
N$32
  Top 0.406: R13.1 LED1.A
REFL1  (via drill 0.6)
  Top 0.406: REFL1.1 R1.1 15.88,52.2 v15.88,54.61
  Bottom 0.406: U$1.P$20 v15.88,54.61
REFL1P  (via drill 0.6)
  Top 0.406: R1.2 v20.95,52.07
  Bottom 0.406: v20.95,52.07 20.95,50.16 24.13,46.99 24.13,33.02 30.48,26.67 31.75,26.67 33.66,24.77 U2.33
REFL2  (via drill 0.6)
  Top 0.406: REFL2.1 R5.1 15.88,48.39 15.88,49.53 16.51,50.16 v22.86,50.16
  Bottom 0.406: U$1.P$19 31.11,53.98 27.3,50.16 v22.86,50.16
REFL2P  (via drill 0.6)
  Top 0.406: R5.2 v20.95,48.26
  Bottom 0.406: v20.95,48.26 23.5,45.72 23.5,31.75 U2.34
REFL3  (via drill 0.6)
  Top 0.406: v25.4,46.35 16.51,46.35 15.88,45.72 15.88,44.58 R9.1 REFL3.1
  Bottom 0.406: U$1.P$18 v25.4,46.35
REFL3P  (via drill 0.6)
  Top 0.406: R9.2 v20.95,44.45
  Bottom 0.406: v20.95,44.45 22.86,42.55 22.86,29.84 U2.35
REFR1  (via drill 0.6)
  Top 0.406: REFR1.1 15.24,36.83 | 15.24,36.83 R3.1 | 15.24,36.83 15.88,37.47 15.88,38.73 16.51,39.37 20.32,39.37 v25.4,44.45
  Bottom 0.406: U$1.P$17 35.56,54.61 v25.4,44.45
REFR1P  (via drill 0.6)
  Top 0.406: R3.2 v20.95,36.83
  Bottom 0.406: v20.95,36.83 21.59,36.83 22.23,36.2 22.23,27.94 U2.36
REFR2  (via drill 0.6)
  Top 0.406: REFR2.1 R7.1 15.88,33.15 15.88,34.29 16.51,34.92 22.23,34.92 26.04,38.73 v26.04,41.27
  Bottom 0.406: U$1.P$22 27.94,43.18 v26.04,41.27
REFR2P  (via drill 0.6)
  Top 0.406: R7.2 v20.95,33.02
  Bottom 0.406: v20.95,33.02 20.95,26.67 U2.37
REFR3
  Top 0.406: REFR3.1 R11.1 15.88,29.34 15.88,30.48 16.51,31.11 20.95,31.11 27.3,37.47 27.3,44.45 U$1.P$21
REFR3P
  Top 0.406: R11.2 18.55,27.18 20.95,24.77 U2.38
SCK  (via drill 0.6)
  Top 0.406: DRV3.P$6 23.5,58.42 v24.13,57.78 | v67.94,57.78 69.22,59.05 DRV1.P$6 | DRV2.P$6 v46.35,57.78 | U$1.P$5 38.73,39.37 29.84,48.26 v29.84,57.78
  Bottom 0.406: v24.13,57.78 v29.84,57.78 | v29.84,57.78 v46.35,57.78 v67.94,57.78 | v29.84,57.78 31.75,57.78 | U$1.P$5 38.73,28.57 40.64,26.67 50.16,26.67 51.44,25.4 U2.26
TS1  (via drill 0.6)
  Top 0.406: TS1.1 55.88,77.47 v54.61,76.2
  Bottom 0.406: v54.61,76.2 33.66,76.2 32.38,74.93 31.11,74.93 30.48,75.56 10.79,75.56 8.26,73.03 8.26,20.95 8.89,20.32 8.89,13.97 10.16,12.7 22.23,12.7 23.5,11.43 U2.4
TS2  (via drill 0.6)
  Top 0.406: TS2.1 33.02,77.47 v31.75,76.2
  Bottom 0.406: v31.75,76.2 10.16,76.2 7.62,73.66 7.62,20.32 8.26,19.68 8.26,13.34 9.53,12.06 19.68,12.06 20.95,10.79 U2.3
TS3  (via drill 0.6)
  Top 0.406: TS3.1 10.16,77.47 8.26,75.56 v7.62,75.56
  Bottom 0.406: v7.62,75.56 6.99,74.93 6.99,19.68 7.62,19.05 7.62,12.7 8.89,11.43 17.14,11.43 18.41,10.16 U2.2
TS4
  Top 0.406: U2.5 26.04,6.99 24.77,5.71 TS4.1
TS5
  Top 0.406: U2.6 TS5.1 29.21,2.54
TS6
  Top 0.406: U2.7 31.11,6.99 32.38,5.71 TS6.1
TSCOM  (via drill 0.6)
  Top 0.406: TSCOM@1.1 52.07,78.74 v50.8,77.47 | TSCOM@2.1 v29.21,77.47 | TSCOM@3.1 v6.35,76.2 | IC1.3 4.45,17.14 3.81,17.78 R4.2 3.94,19.68 5.08,19.68 v6.35,18.41 | v8.89,2.54 15.88,2.54 TSCOM@4.1 TSCOM@5.1
  Bottom 0.406: v50.8,77.47 v29.21,77.47 7.62,77.47 v6.35,76.2 v6.35,18.41 6.99,17.78 6.99,4.45 v8.89,2.54
UARTRX
  Top 0.406: RX.1 65.41,11.43 64.14,10.16 U2.20
UARTTX
  Top 0.406: TX.1 64.77,15.24 61.59,12.06 U2.19
VCC  (1 unrouted)
  Top 0.813: C4.1 VCC@2.1 | C3.1 76.97,46.23 VCC@3.1 75.19,45.98 U1.1
  Top 1.676: VCC@1.1 VCC@2.1 77.47,55.88 77.47,69.85 | 77.47,69.85 77.47,70.48 DRV1.P$9 | 77.47,69.85 51.44,69.85 | 51.44,69.85 31.75,69.85 28.57,73.03 DRV3.P$9 | DRV2.P$9 51.44,69.85

### Text on the board
tPlace: VCC | 5V | GND | GND | STEPPER DRIVE | ELECTRONICS | R3 | TSCOM